# Altium schematic sheet PL133-37.SchDoc
size A; SheetNumber: 1; SheetTotal: 1
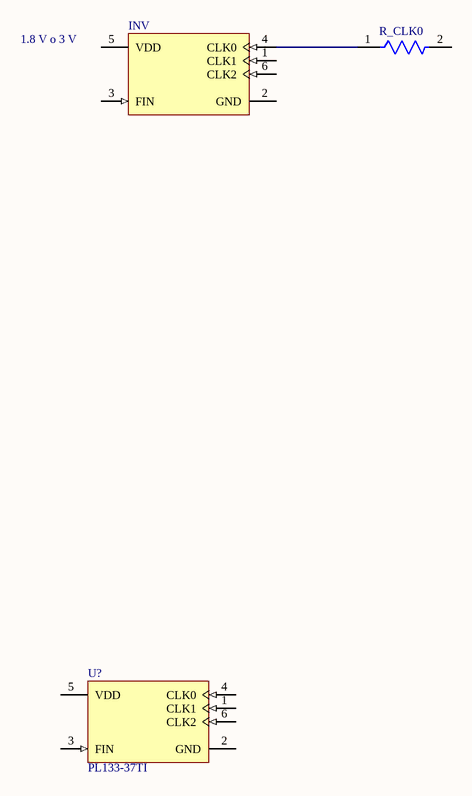
[diagram p0: PL133-37.SchDoc]

## Parts
INV  PL133-37TI  [FP-SOT23-6LD-PL-1-MFG]  (value not drawn)
R_CLK0  AC0603FR-0730RL  [FP-AC0603-IPC_B]  (value not drawn)
U?  PL133-37TI  [FP-SOT23-6LD-PL-1-MFG]

## Nets
NetINV_4: INV.4(CLK0) R_CLK0.1

Not connected (* = marked no-connect by the designer): INV 1(CLK1) 2(GND) 3(FIN) 5(VDD) 6(CLK2); R_CLK0 2; U? 1(CLK1) 2(GND) 3(FIN) 4(CLK0) 5(VDD) 6(CLK2)

## Notes on the sheet
- (near INV) 1.8 V o 3 V

## Library data of the parts
INV U? = CMP-00252-66952958-1: PL133-37TI LVCMOS Sine Wave PL133 SOT-23-6 R-PDSO-G6 clock driver 0.95mm 1.62V~3.63V 150MHz -40C~85C; Number of Circuits: 1; Logic Function: Inverting; Min Supply Voltage: 1.62V; Max Supply Voltage: 3.63V; Number of Outputs: 3; Lifecycle Status: Production; Max Frequency: 150MHz; Schedule B: 8542390000, 8542390000; Mount: Surface Mount; Max Operating Temperature: 85°C; Number of Elements: 1; Lead Free: Lead Free; RoHS: Compliant; Min Operating Temperature: -40°C; Number of Inputs: 1; Input: LVCMOS; Height: 1.45mm
R_CLK0 = CMP-03412-028950-2: RES 30Ω 1.00% 0.1W 0603; Tolerance: 1%; Max Power Dissipation: 100mW; Temperature Coefficient: 100ppm/°C; Resistance: 30R; Features: Moisture Resistant; Packaging: Tape and Reel; Number of Terminations: 2; Case/Package: 0603; Length: 0.063inch; Resistor Type: Thick Film; Series: AC; RoHS Compliant: Yes; Height: 0.022inch; Width: 0.031inch; Max Operating Temperature: 155°C; Min Operating Temperature: -55°C